# Altium schematic sheet NODE_Top_V2.SchDoc: PDOA Kit Node
size A3; Organization: Decawave Ltd.; Address1: Adelaide Chambers,; Address2: Peter Street,; Address3: Dublin 8,; Address4: Ireland.; DocumentNumber: 1; Revision: 2v2; SheetNumber: 1; SheetTotal: 5; SheetFunction: Top Level; ProjectName: PDOA Kit Node
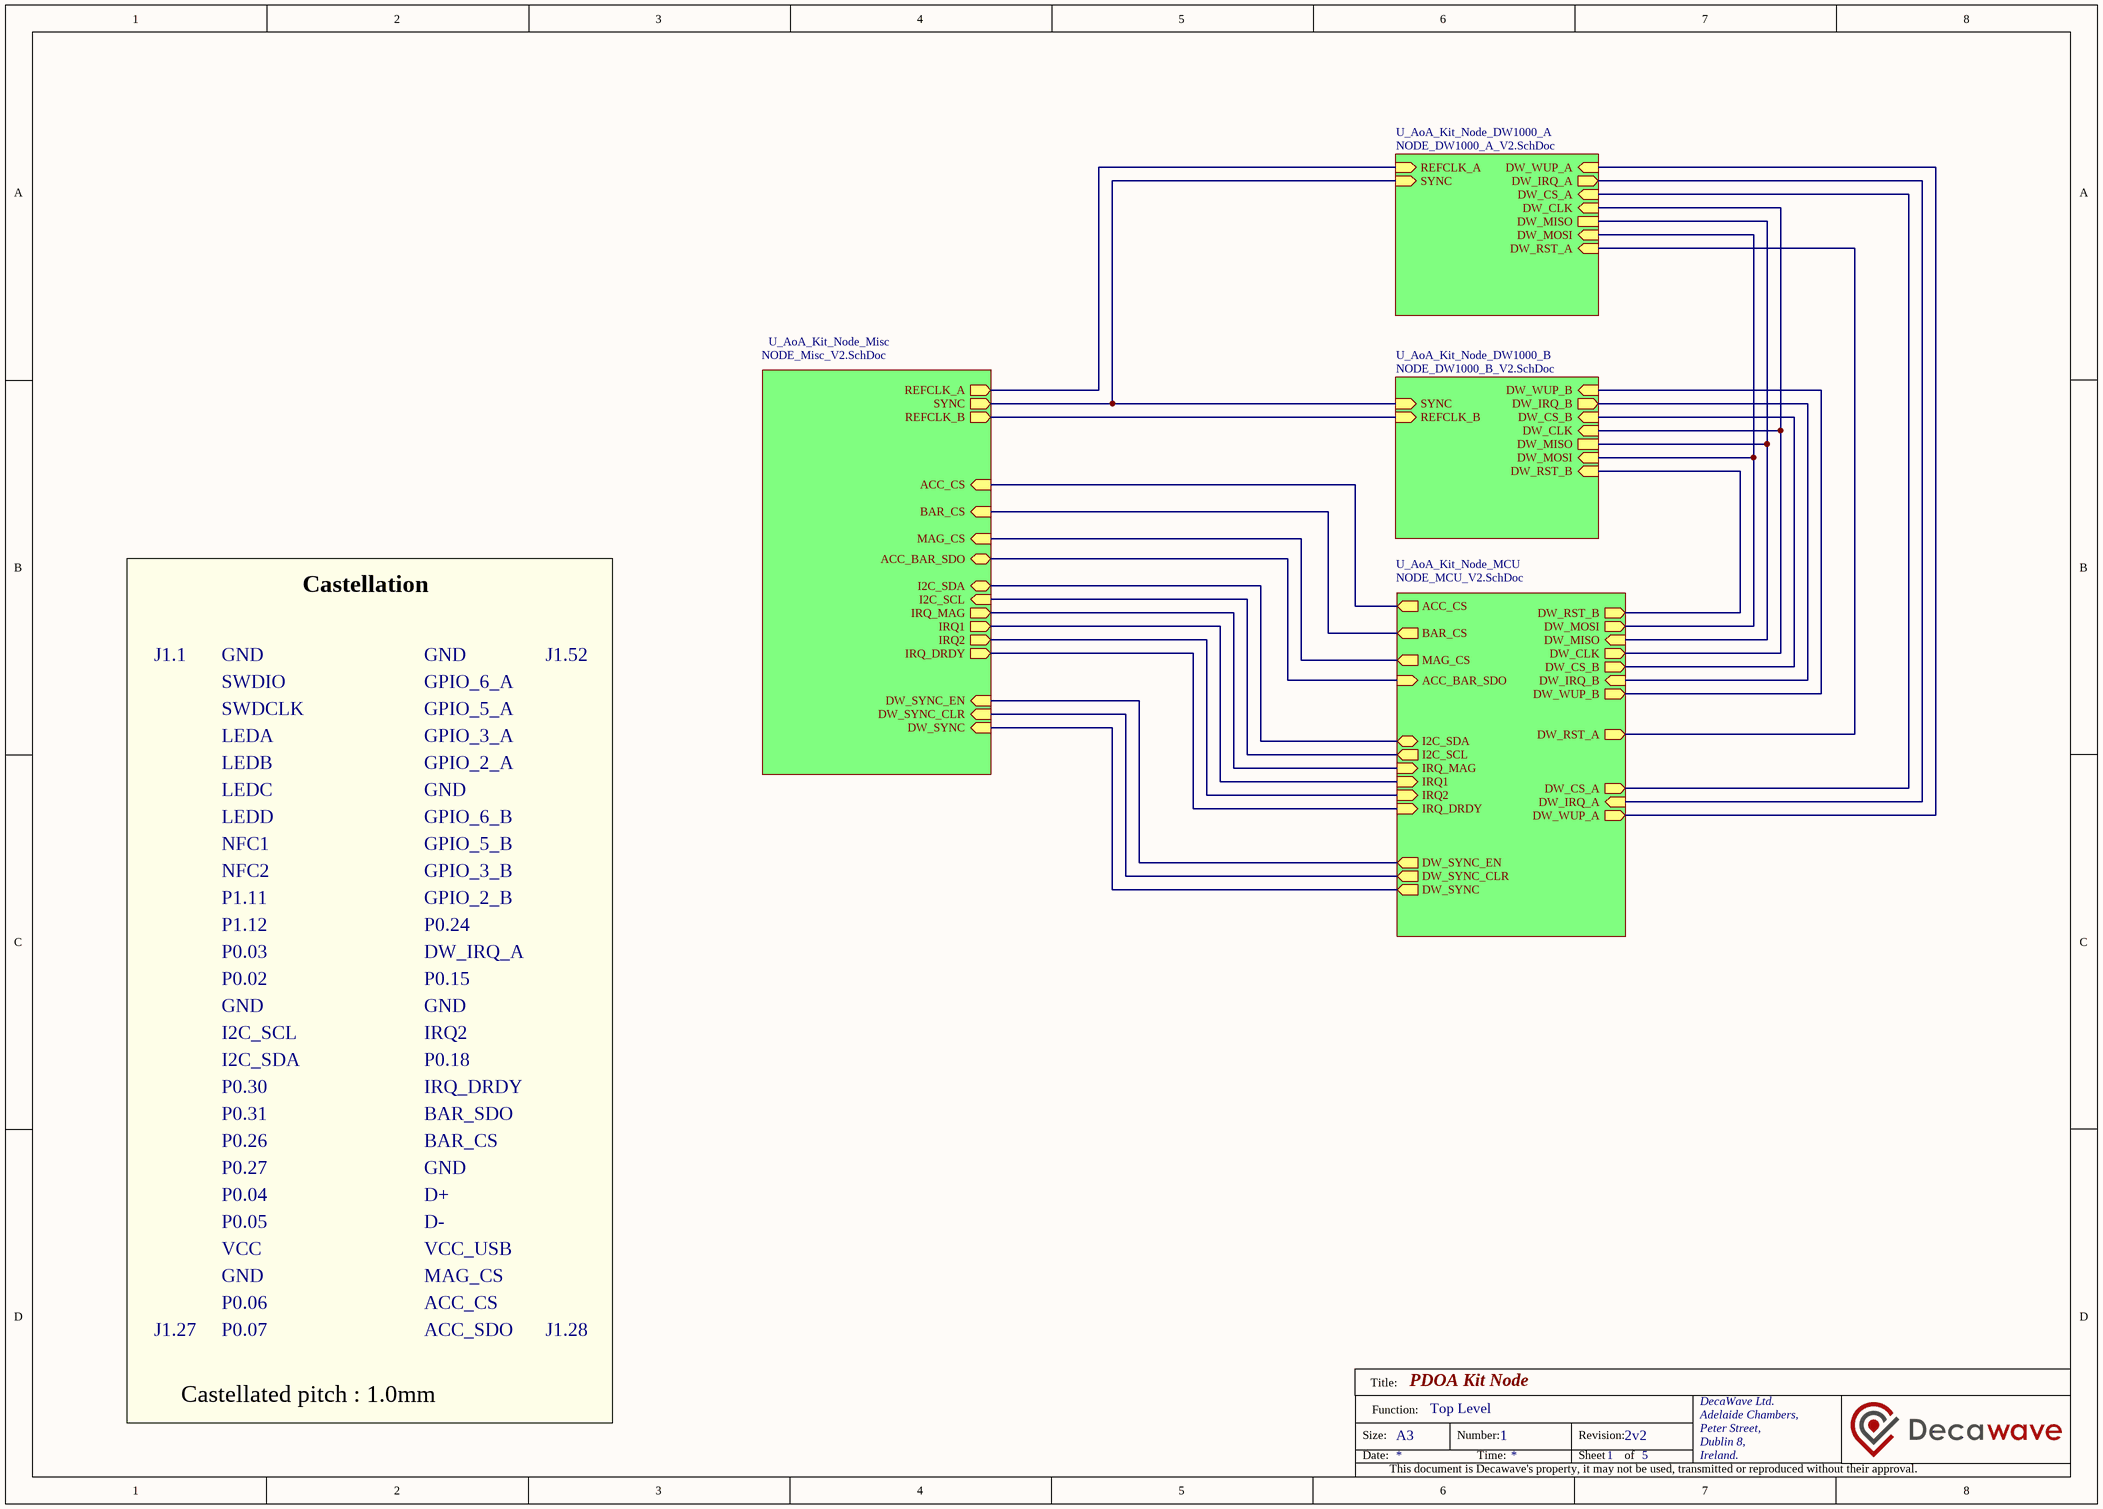
[diagram p0: NODE_Top_V2.SchDoc]

## Sub-sheets
U_AoA_Kit_Node_DW1000_A = NODE_DW1000_A_V2.SchDoc: DW_MOSI (in), DW_IRQ_A (out), DW_CS_A (in), DW_WUP_A (in), DW_MISO, DW_CLK (in), REFCLK_A (in), SYNC (in), DW_RST_A (in)
U_AoA_Kit_Node_DW1000_B = NODE_DW1000_B_V2.SchDoc: DW_MOSI (in), DW_IRQ_B (out), DW_CS_B (in), DW_WUP_B (in), DW_MISO, DW_CLK (in), REFCLK_B (in), SYNC (in), DW_RST_B (in)
U_AoA_Kit_Node_MCU = NODE_MCU_V2.SchDoc: DW_IRQ_A (in), DW_CS_A (out), DW_CS_B (out), DW_SYNC_EN (out), DW_SYNC_CLR (out), DW_SYNC (out), DW_MISO (in), DW_RST_A (out), DW_MOSI (out), DW_CLK (out), I2C_SDA (bidir), I2C_SCL (out), IRQ_MAG (in), IRQ1 (in), IRQ2 (in), IRQ_DRDY (in), DW_WUP_B (out), DW_IRQ_B (in), DW_RST_B (out), DW_WUP_A (out), ACC_CS (out), BAR_CS (out), MAG_CS (out), ACC_BAR_SDO (in)
U_AoA_Kit_Node_Misc = NODE_Misc_V2.SchDoc: REFCLK_B (out), REFCLK_A (out), SYNC (out), DW_SYNC_EN (in), DW_SYNC (in), DW_SYNC_CLR (in), I2C_SCL (in), I2C_SDA (bidir), IRQ_MAG (out), IRQ1 (out), IRQ2 (out), IRQ_DRDY (out), ACC_CS (in), BAR_CS (in), MAG_CS (in), ACC_BAR_SDO (bidir)

## Nets
(unnamed): sheet U_AoA_Kit_Node_Misc/REFCLK_B, sheet U_AoA_Kit_Node_DW1000_B/REFCLK_B
(unnamed): sheet U_AoA_Kit_Node_Misc/REFCLK_A, sheet U_AoA_Kit_Node_DW1000_A/REFCLK_A
(unnamed): sheet U_AoA_Kit_Node_Misc/SYNC, sheet U_AoA_Kit_Node_DW1000_A/SYNC, sheet U_AoA_Kit_Node_DW1000_B/SYNC
(unnamed): sheet U_AoA_Kit_Node_Misc/DW_SYNC_EN, sheet U_AoA_Kit_Node_MCU/DW_SYNC_EN
(unnamed): sheet U_AoA_Kit_Node_Misc/DW_SYNC, sheet U_AoA_Kit_Node_MCU/DW_SYNC
(unnamed): sheet U_AoA_Kit_Node_Misc/DW_SYNC_CLR, sheet U_AoA_Kit_Node_MCU/DW_SYNC_CLR
(unnamed): sheet U_AoA_Kit_Node_Misc/I2C_SCL, sheet U_AoA_Kit_Node_MCU/I2C_SCL
(unnamed): sheet U_AoA_Kit_Node_Misc/I2C_SDA, sheet U_AoA_Kit_Node_MCU/I2C_SDA
(unnamed): sheet U_AoA_Kit_Node_Misc/IRQ_MAG, sheet U_AoA_Kit_Node_MCU/IRQ_MAG
(unnamed): sheet U_AoA_Kit_Node_Misc/IRQ1, sheet U_AoA_Kit_Node_MCU/IRQ1
(unnamed): sheet U_AoA_Kit_Node_Misc/IRQ2, sheet U_AoA_Kit_Node_MCU/IRQ2
(unnamed): sheet U_AoA_Kit_Node_Misc/IRQ_DRDY, sheet U_AoA_Kit_Node_MCU/IRQ_DRDY
(unnamed): sheet U_AoA_Kit_Node_Misc/ACC_CS, sheet U_AoA_Kit_Node_MCU/ACC_CS
(unnamed): sheet U_AoA_Kit_Node_Misc/BAR_CS, sheet U_AoA_Kit_Node_MCU/BAR_CS
(unnamed): sheet U_AoA_Kit_Node_Misc/MAG_CS, sheet U_AoA_Kit_Node_MCU/MAG_CS
(unnamed): sheet U_AoA_Kit_Node_Misc/ACC_BAR_SDO, sheet U_AoA_Kit_Node_MCU/ACC_BAR_SDO
(unnamed): sheet U_AoA_Kit_Node_MCU/DW_IRQ_A, sheet U_AoA_Kit_Node_DW1000_A/DW_IRQ_A
(unnamed): sheet U_AoA_Kit_Node_MCU/DW_CS_A, sheet U_AoA_Kit_Node_DW1000_A/DW_CS_A
(unnamed): sheet U_AoA_Kit_Node_MCU/DW_CS_B, sheet U_AoA_Kit_Node_DW1000_B/DW_CS_B
(unnamed): sheet U_AoA_Kit_Node_MCU/DW_MISO, sheet U_AoA_Kit_Node_DW1000_A/DW_MISO, sheet U_AoA_Kit_Node_DW1000_B/DW_MISO
(unnamed): sheet U_AoA_Kit_Node_MCU/DW_RST_A, sheet U_AoA_Kit_Node_DW1000_A/DW_RST_A
(unnamed): sheet U_AoA_Kit_Node_MCU/DW_MOSI, sheet U_AoA_Kit_Node_DW1000_A/DW_MOSI, sheet U_AoA_Kit_Node_DW1000_B/DW_MOSI
(unnamed): sheet U_AoA_Kit_Node_MCU/DW_CLK, sheet U_AoA_Kit_Node_DW1000_A/DW_CLK, sheet U_AoA_Kit_Node_DW1000_B/DW_CLK
(unnamed): sheet U_AoA_Kit_Node_MCU/DW_WUP_B, sheet U_AoA_Kit_Node_DW1000_B/DW_WUP_B
(unnamed): sheet U_AoA_Kit_Node_MCU/DW_IRQ_B, sheet U_AoA_Kit_Node_DW1000_B/DW_IRQ_B
(unnamed): sheet U_AoA_Kit_Node_MCU/DW_RST_B, sheet U_AoA_Kit_Node_DW1000_B/DW_RST_B
(unnamed): sheet U_AoA_Kit_Node_MCU/DW_WUP_A, sheet U_AoA_Kit_Node_DW1000_A/DW_WUP_A

## Notes on the sheet
- Sheet 2
- Castellation
- J1.1
- GND
- SWDIO
- SWDCLK
- GPIO_5_A
- GPIO_6_A
- J1.52
- LEDA
- LEDB
- GPIO_2_A
- GPIO_3_A
- LEDC
- LEDD
- NFC1
- GPIO_5_B
- GPIO_6_B
- NFC2
- P1.11
- GPIO_2_B
- GPIO_3_B
- P1.12
- P0.03
- P0.02
- P0.15
- DW_IRQ_A
- P0.24
- I2C_SCL
- IRQ2
- I2C_SDA
- P0.30
- P0.31
- BAR_SDO
- IRQ_DRDY
- P0.18
- P0.26
- P0.27
- BAR_CS
- P0.04
- P0.05
- VCC
- VCC_USB
- D-
- D+
- P0.06
- ACC_CS
- MAG_CS
- J1.27
- P0.07
- ACC_SDO
- J1.28
- Castellated pitch : 1.0mm
- Title:
- Size:
- Date:
- Function:
- A3
- Number:
- Time:
- Revision:
- Sheet
- of
- DecaWave Ltd.
- Adelaide Chambers,
- Peter Street,
- Dublin 8,
- Ireland.
- This document is Decawave's property, it may not be used, transmitted or reproduced without their approval.